# EAGLE board 1203_05 (EAGLE 7.1.0), part 1 of 3
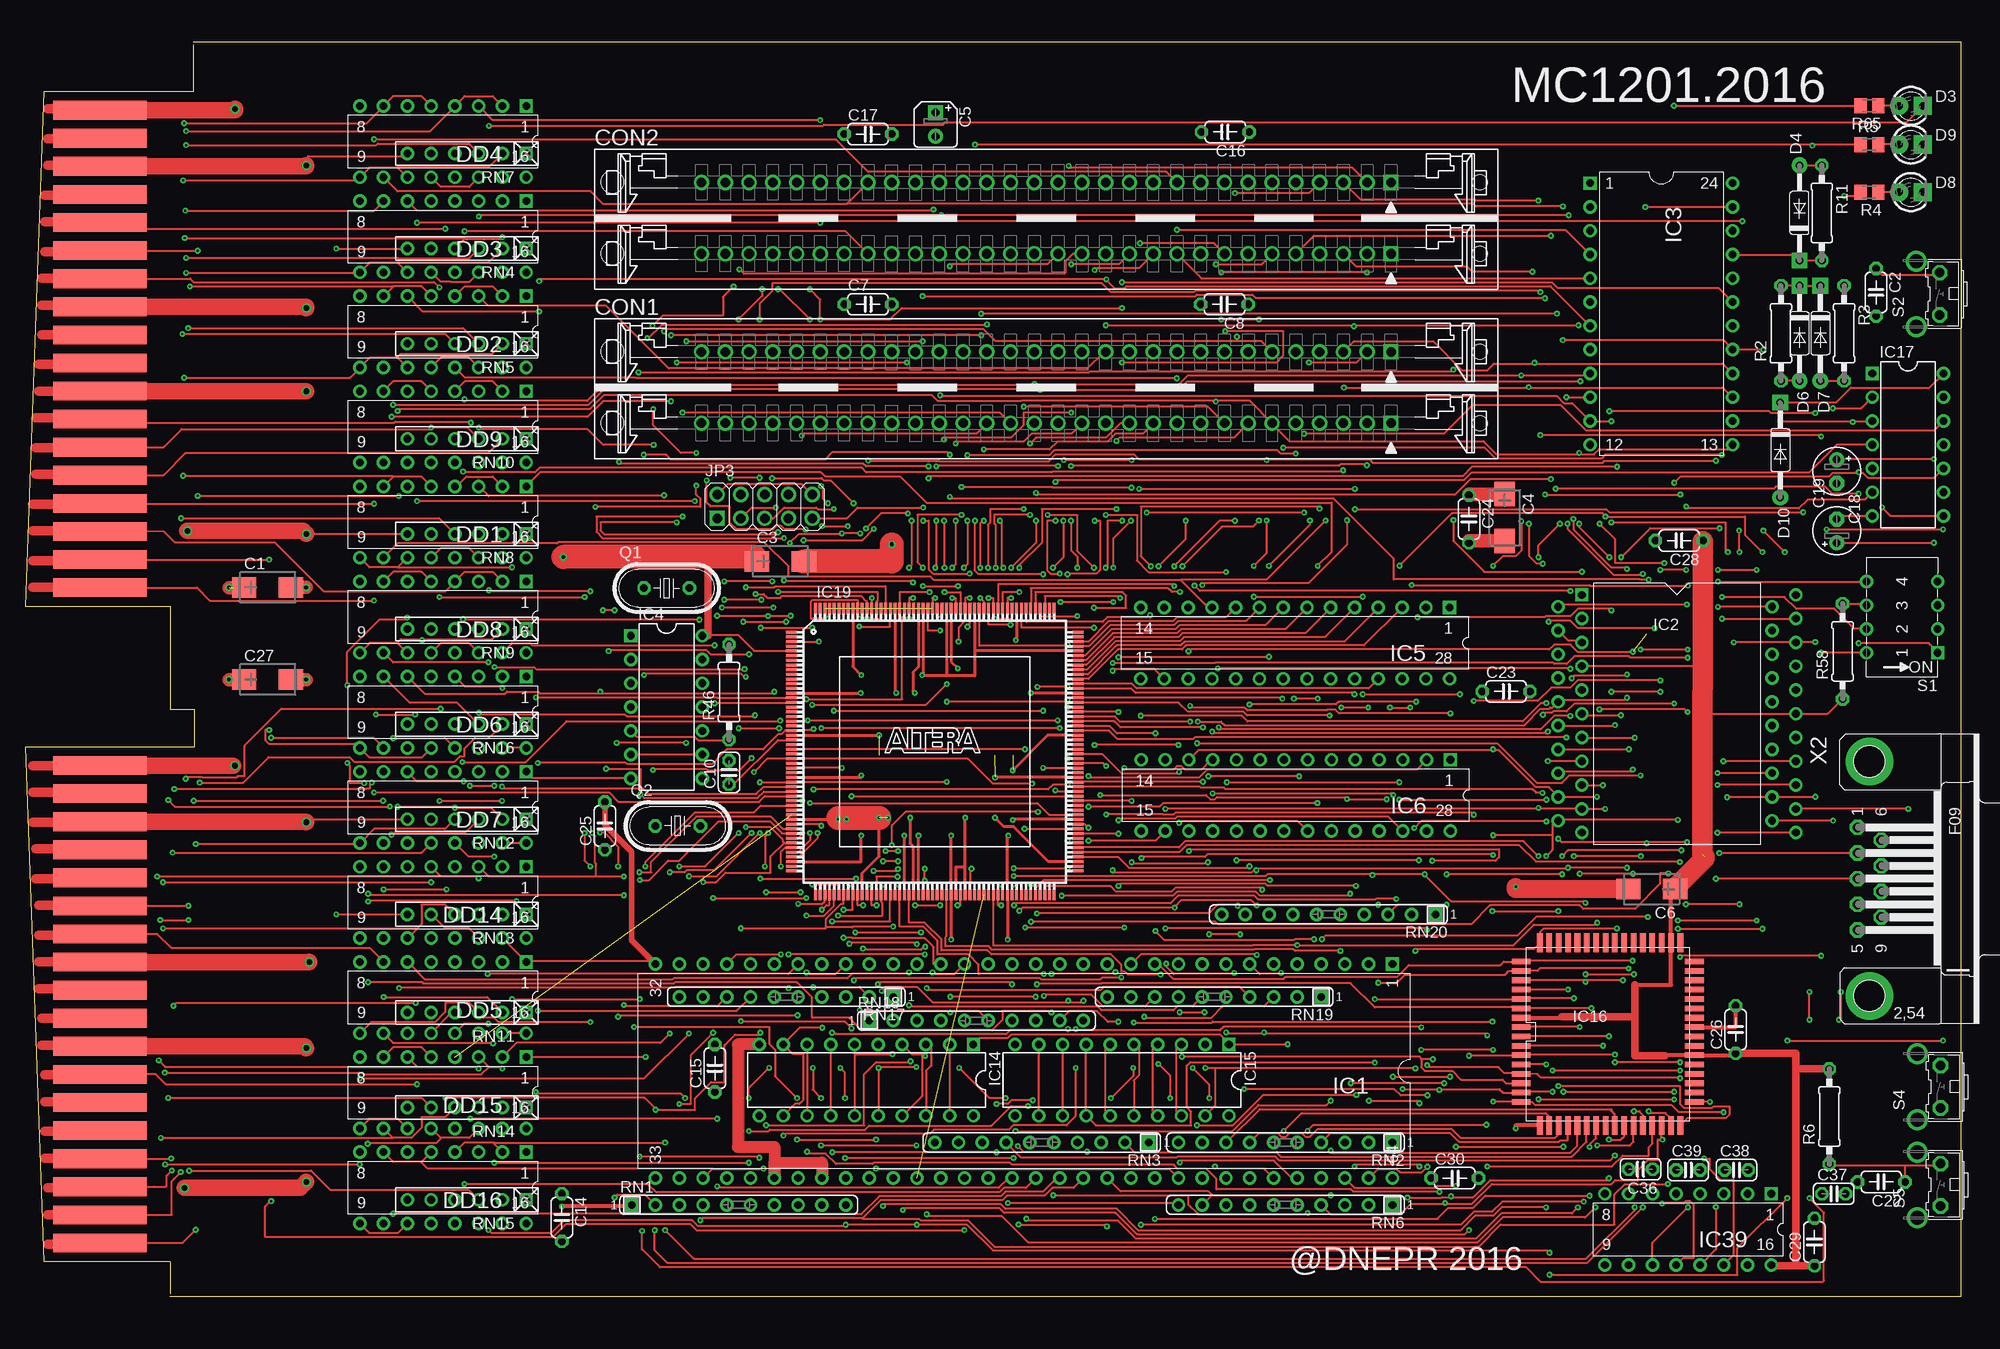
[diagram p2: board, top side]
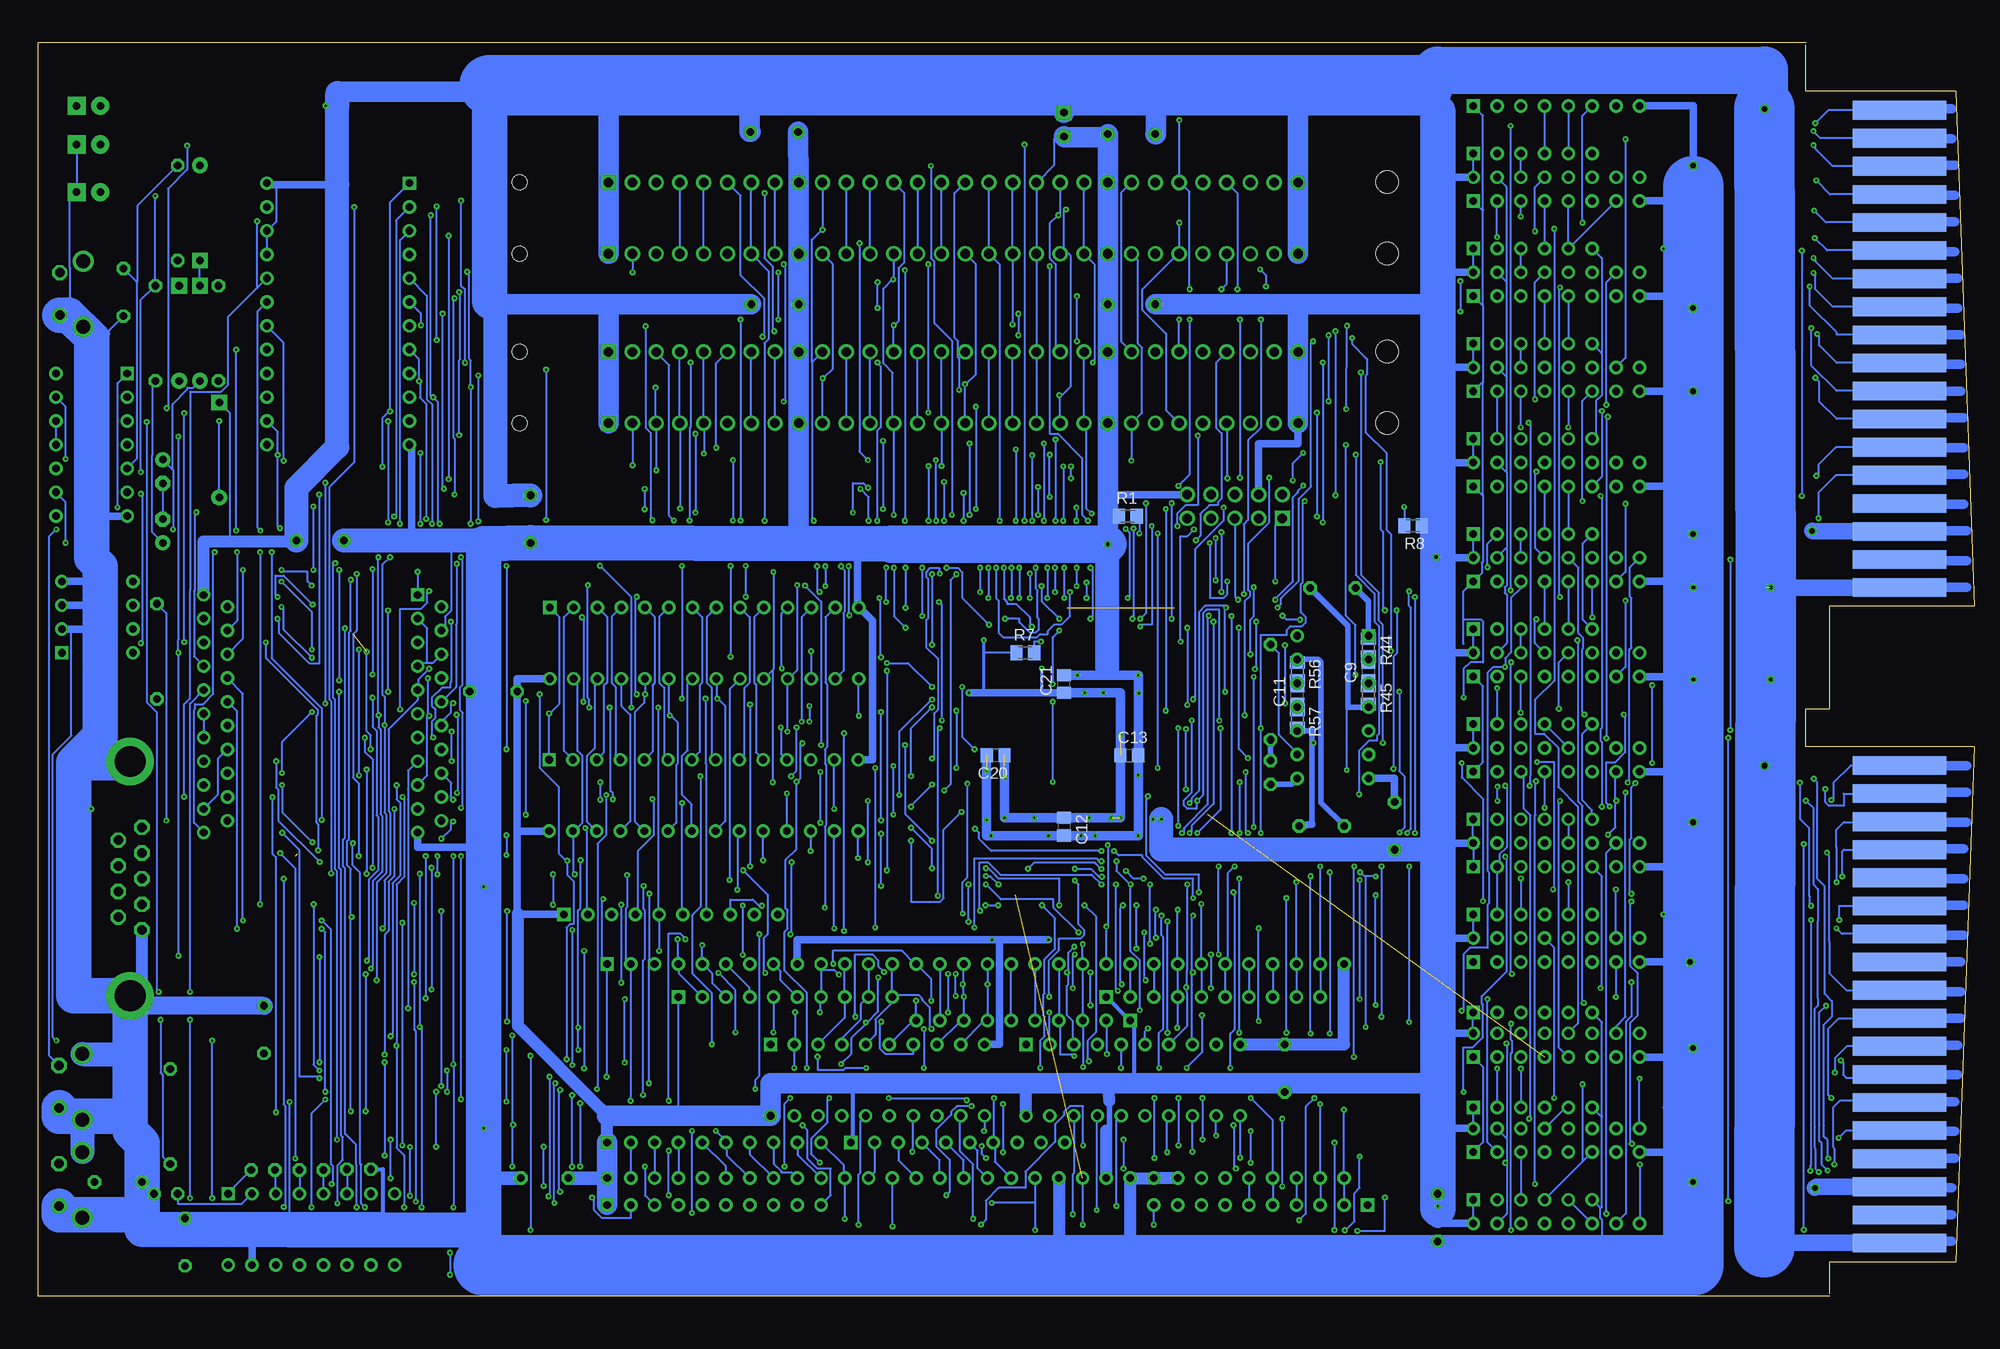
[diagram p3: board, bottom side, seen from below]

Size 206.86 x 133.97 mm. Coordinates in mm from the lower left corner, seen from the top.
Outline: 15.43,0 206.86,0 206.86,133.97 17.97,133.97
Copper layers (1+2*16): Top 0.035mm / dielectric 0.75mm / Route2 0.035mm / dielectric 0.75mm / Bottom 0.035mm
Design rules "default *": minimum track width 8mil, minimum drill 8mil, track to track 8mil, track to pad 8mil, pad to pad 8mil, via to via 8mil, smd to smd 8mil, copper to edge 40mil, drill to drill 8mil, minimum pad ring 12mil, minimum via ring 8mil, stop-mask expansion 0mil, vias tented up to drill 0mil, thermal gap 10mil

## Footprints (pad centres in the part's own frame; a part is rotated, then mirrored left to right if it is on the bottom)
CT6032 = smd 2.6 x 2.2: + -2.5,0; - 2.5,0
C050-024X044 = drill 0.813 octagon: 1 -2.54,0; 2 2.54,0
B45181A = drill 0.813 pad 1.6 square: + -1.27,0 | drill 0.813 pad 1.6: - 1.27,0
C0805 = smd 1.3 x 1.5: 1 -0.95,0; 2 0.95,0
C025-024X044 = drill 0.813 octagon: 1 -1.27,0; 2 1.27,0
E2,5-5 = drill 0.813 pad 1.6: + -1.27,0 | drill 0.813 pad 1.6 octagon: - 1.27,0
SIMM30-2 = drill 1.016 square: 1 35.56,3.81; 1A 35.56,-3.81 | drill 1.016: 2 33.02,3.81; 2A 33.02,-3.81; 3 30.48,3.81; 3A 30.48,-3.81; 4 27.94,3.81; 4A 27.94,-3.81; 5 25.4,3.81; 5A 25.4,-3.81; 6 22.86,3.81; 6A 22.86,-3.81; 7 20.32,3.81; 7A 20.32,-3.81; 8 17.78,3.81; 8A 17.78,-3.81; 9 15.24,3.81; 9A 15.24,-3.81; 10 12.7,3.81; 10A 12.7,-3.81; 11 10.16,3.81; 11A 10.16,-3.81; 12 7.62,3.81; 12A 7.62,-3.81; 13 5.08,3.81; 13A 5.08,-3.81; 14 2.54,3.81; 14A 2.54,-3.81; 15 0,3.81; 15A 0,-3.81; 16 -2.54,3.81; 16A -2.54,-3.81; 17 -5.08,3.81; 17A -5.08,-3.81; 18 -7.62,3.81; 18A -7.62,-3.81; 19 -10.16,3.81; 19A -10.16,-3.81; 20 -12.7,3.81; 20A -12.7,-3.81; 21 -15.24,3.81; 21A -15.24,-3.81; 22 -17.78,3.81; 22A -17.78,-3.81; 23 -20.32,3.81; 23A -20.32,-3.81; 24 -22.86,3.81; 24A -22.86,-3.81; 25 -25.4,3.81; 25A -25.4,-3.81; 26 -27.94,3.81; 26A -27.94,-3.81; 27 -30.48,3.81; 27A -30.48,-3.81; 28 -33.02,3.81; 28A -33.02,-3.81; 29 -35.56,3.81; 29A -35.56,-3.81; 30 -38.1,3.81; 30A -38.1,-3.81 | hole 2.413: -47.65,3.835; -47.65,-3.785 | hole 1.6: 45.085,3.81; 45.085,-3.81
LED3MM = drill 0.813 pad 1.93: A -1.27,0 | drill 0.813 pad 1.93 square: K 1.27,0
DO35-10 = drill 0.813 pad 1.676: A 5.08,0 | drill 0.813 pad 1.676 square: K -5.08,0
DIL16 = drill 0.813 square: 1 -8.89,-3.81 | drill 0.813: 2 -6.35,-3.81; 3 -3.81,-3.81; 4 -1.27,-3.81; 5 1.27,-3.81; 6 3.81,-3.81; 7 6.35,-3.81; 8 8.89,-3.81; 9 8.89,3.81; 10 6.35,3.81; 11 3.81,3.81; 12 1.27,3.81; 13 -1.27,3.81; 14 -3.81,3.81; 15 -6.35,3.81; 16 -8.89,3.81
DIL64 = drill 0.813 square: 1 -39.37,-11.43 | drill 0.813: 2 -36.83,-11.43; 3 -34.29,-11.43; 4 -31.75,-11.43; 5 -29.21,-11.43; 6 -26.67,-11.43; 7 -24.13,-11.43; 8 -21.59,-11.43; 9 -19.05,-11.43; 10 -16.51,-11.43; 11 -13.97,-11.43; 12 -11.43,-11.43; 13 -8.89,-11.43; 14 -6.35,-11.43; 15 -3.81,-11.43; 16 -1.27,-11.43; 17 1.27,-11.43; 18 3.81,-11.43; 19 6.35,-11.43; 20 8.89,-11.43; 21 11.43,-11.43; 22 13.97,-11.43; 23 16.51,-11.43; 24 19.05,-11.43; 25 21.59,-11.43; 26 24.13,-11.43; 27 26.67,-11.43; 28 29.21,-11.43; 29 31.75,-11.43; 30 34.29,-11.43; 31 36.83,-11.43; 32 39.37,-11.43; 33 39.37,11.43; 34 36.83,11.43; 35 34.29,11.43; 36 31.75,11.43; 37 29.21,11.43; 38 26.67,11.43; 39 24.13,11.43; 40 21.59,11.43; 41 19.05,11.43; 42 16.51,11.43; 43 13.97,11.43; 44 11.43,11.43; 45 8.89,11.43; 46 6.35,11.43; 47 3.81,11.43; 48 1.27,11.43; 49 -1.27,11.43; 50 -3.81,11.43; 51 -6.35,11.43; 52 -8.89,11.43; 53 -11.43,11.43; 54 -13.97,11.43; 55 -16.51,11.43; 56 -19.05,11.43; 57 -21.59,11.43; 58 -24.13,11.43; 59 -26.67,11.43; 60 -29.21,11.43; 61 -31.75,11.43; 62 -34.29,11.43; 63 -36.83,11.43; 64 -39.37,11.43
1801 = drill 0.813 square: 1 -10.16,12.7 | drill 0.813: 2 -12.7,11.43; 3 -10.16,10.16; 4 -12.7,8.89; 5 -10.16,7.62; 6 -12.7,6.35; 7 -10.16,5.08; 8 -12.7,3.81; 9 -10.16,2.54; 10 -12.7,1.27; 11 -10.16,0; 12 -12.7,-1.27; 13 -10.16,-2.54; 14 -12.7,-3.81; 15 -10.16,-5.08; 16 -12.7,-6.35; 17 -10.16,-7.62; 18 -12.7,-8.89; 19 -10.16,-10.16; 20 -12.7,-11.43; 21 -10.16,-12.7; 22 12.7,-12.7; 23 10.16,-11.43; 24 12.7,-10.16; 25 10.16,-8.89; 26 12.7,-7.62; 27 10.16,-6.35; 28 12.7,-5.08; 29 10.16,-3.81; 30 12.7,-2.54; 31 10.16,-1.27; 32 12.7,0; 33 10.16,1.27; 34 12.7,2.54; 35 10.16,3.81; 36 12.7,5.08; 37 10.16,6.35; 38 12.7,7.62; 39 10.16,8.89; 40 12.7,10.16; 41 10.16,11.43; 42 12.7,12.7
DIL24 = drill 0.813 square: 1 -13.97,-7.62 | drill 0.813: 2 -11.43,-7.62; 3 -8.89,-7.62; 4 -6.35,-7.62; 5 -3.81,-7.62; 6 -1.27,-7.62; 7 1.27,-7.62; 8 3.81,-7.62; 9 6.35,-7.62; 10 8.89,-7.62; 11 11.43,-7.62; 12 13.97,-7.62; 13 13.97,7.62; 14 11.43,7.62; 15 8.89,7.62; 16 6.35,7.62; 17 3.81,7.62; 18 1.27,7.62; 19 -1.27,7.62; 20 -3.81,7.62; 21 -6.35,7.62; 22 -8.89,7.62; 23 -11.43,7.62; 24 -13.97,7.62
DIL14 = drill 0.813 square: 1 -7.62,-3.81 | drill 0.813: 2 -5.08,-3.81; 3 -2.54,-3.81; 4 0,-3.81; 5 2.54,-3.81; 6 5.08,-3.81; 7 7.62,-3.81; 8 7.62,3.81; 9 5.08,3.81; 10 2.54,3.81; 11 0,3.81; 12 -2.54,3.81; 13 -5.08,3.81; 14 -7.62,3.81
DIL28-3 = drill 0.813 square: 1 -16.51,-3.81 | drill 0.813: 2 -13.97,-3.81; 3 -11.43,-3.81; 4 -8.89,-3.81; 5 -6.35,-3.81; 6 -3.81,-3.81; 7 -1.27,-3.81; 8 1.27,-3.81; 9 3.81,-3.81; 10 6.35,-3.81; 11 8.89,-3.81; 12 11.43,-3.81; 13 13.97,-3.81; 14 16.51,-3.81; 15 16.51,3.81; 16 13.97,3.81; 17 11.43,3.81; 18 8.89,3.81; 19 6.35,3.81; 20 3.81,3.81; 21 1.27,3.81; 22 -1.27,3.81; 23 -3.81,3.81; 24 -6.35,3.81; 25 -8.89,3.81; 26 -11.43,3.81; 27 -13.97,3.81; 28 -16.51,3.81
DIL20 = drill 0.813 square: 1 -11.43,-3.81 | drill 0.813: 2 -8.89,-3.81; 3 -6.35,-3.81; 4 -3.81,-3.81; 5 -1.27,-3.81; 6 1.27,-3.81; 7 3.81,-3.81; 8 6.35,-3.81; 9 8.89,-3.81; 10 11.43,-3.81; 11 11.43,3.81; 12 8.89,3.81; 13 6.35,3.81; 14 3.81,3.81; 15 1.27,3.81; 16 -1.27,3.81; 17 -3.81,3.81; 18 -6.35,3.81; 19 -8.89,3.81; 20 -11.43,3.81
1801VM4 = smd 2 x 0.6: 1 -9.5,-0.5; 2 -9.5,-1.5; 3 -9.5,-2.5; 4 -9.5,-3.5; 5 -9.5,-4.5; 6 -9.5,-5.5; 7 -9.5,-6.5; 8 -9.5,-7.5; 25 9,-7.5; 26 9,-6.5; 27 9,-5.5; 28 9,-4.5; 29 9,-3.5; 30 9,-2.5; 31 9,-1.5; 32 9,-0.5; 33 9,0.5; 34 9,1.5; 35 9,2.5; 36 9,3.5; 37 9,4.5; 38 9,5.5; 39 9,6.5; 40 9,7.5; 57 -9.5,7.5; 58 -9.5,6.5; 59 -9.5,5.5; 60 -9.5,4.5; 61 -9.5,3.5; 62 -9.5,2.5; 63 -9.5,1.5; 64 -9.5,0.5 | smd 0.6 x 2: 9 -7.5,-10; 10 -6.5,-10; 11 -5.5,-10; 12 -4.5,-10; 13 -3.5,-10; 14 -2.5,-10; 15 -1.5,-10; 16 -0.5,-10; 17 0.5,-10; 18 1.5,-10; 19 2.5,-10; 20 3.5,-10; 21 4.5,-10; 22 5.5,-10; 23 6.5,-10; 24 7.5,-10; 41 7.5,9.5; 42 6.5,9.5; 43 5.5,9.5; 44 4.5,9.5; 45 3.5,9.5; 46 2.5,9.5; 47 1.5,9.5; 48 0.5,9.5; 49 -0.5,9.5; 50 -1.5,9.5; 51 -2.5,9.5; 52 -3.5,9.5; 53 -4.5,9.5; 54 -5.5,9.5; 55 -6.5,9.5; 56 -7.5,9.5
RQFP208 = smd 1.2 x 0.32: 1 -15.3,12.75; 2 -15.3,12.25; 3 -15.3,11.75; 4 -15.3,11.25; 5 -15.3,10.75; 6 -15.3,10.25; 7 -15.3,9.75; 8 -15.3,9.25; 9 -15.3,8.75; 10 -15.3,8.25; 11 -15.3,7.75; 12 -15.3,7.25; 13 -15.3,6.75; 14 -15.3,6.25; 15 -15.3,5.75; 16 -15.3,5.25; 17 -15.3,4.75; 18 -15.3,4.25; 19 -15.3,3.75; 20 -15.3,3.25; 21 -15.3,2.75; 22 -15.3,2.25; 23 -15.3,1.75; 24 -15.3,1.25; 25 -15.3,0.75; 26 -15.3,0.25; 27 -15.3,-0.25; 28 -15.3,-0.75; 29 -15.3,-1.25; 30 -15.3,-1.75; 31 -15.3,-2.25; 32 -15.3,-2.75; 33 -15.3,-3.25; 34 -15.3,-3.75; 35 -15.3,-4.25; 36 -15.3,-4.75; 37 -15.3,-5.25; 38 -15.3,-5.75; 39 -15.3,-6.25; 40 -15.3,-6.75; 41 -15.3,-7.25; 42 -15.3,-7.75; 43 -15.3,-8.25; 44 -15.3,-8.75; 45 -15.3,-9.25; 46 -15.3,-9.75; 47 -15.3,-10.25; 48 -15.3,-10.75; 49 -15.3,-11.25; 50 -15.3,-11.75; 51 -15.3,-12.25; 52 -15.3,-12.75; 105 15.3,-12.75; 106 15.3,-12.25; 107 15.3,-11.75; 108 15.3,-11.25; 109 15.3,-10.75; 110 15.3,-10.25; 111 15.3,-9.75; 112 15.3,-9.25; 113 15.3,-8.75; 114 15.3,-8.25; 115 15.3,-7.75; 116 15.3,-7.25; 117 15.3,-6.75; 118 15.3,-6.25; 119 15.3,-5.75; 120 15.3,-5.25; 121 15.3,-4.75; 122 15.3,-4.25; 123 15.3,-3.75; 124 15.3,-3.25; 125 15.3,-2.75; 126 15.3,-2.25; 127 15.3,-1.75; 128 15.3,-1.25; 129 15.3,-0.75; 130 15.3,-0.25; 131 15.3,0.25; 132 15.3,0.75; 133 15.3,1.25; 134 15.3,1.75; 135 15.3,2.25; 136 15.3,2.75; 137 15.3,3.25; 138 15.3,3.75; 139 15.3,4.25; 140 15.3,4.75; 141 15.3,5.25; 142 15.3,5.75; 143 15.3,6.25; 144 15.3,6.75; 145 15.3,7.25; 146 15.3,7.75; 147 15.3,8.25; 148 15.3,8.75; 149 15.3,9.25; 150 15.3,9.75; 151 15.3,10.25; 152 15.3,10.75; 153 15.3,11.25; 154 15.3,11.75; 155 15.3,12.25; 156 15.3,12.75 | smd 0.32 x 1.2: 53 -12.75,-15.3; 54 -12.25,-15.3; 55 -11.75,-15.3; 56 -11.25,-15.3; 57 -10.75,-15.3; 58 -10.25,-15.3; 59 -9.75,-15.3; 60 -9.25,-15.3; 61 -8.75,-15.3; 62 -8.25,-15.3; 63 -7.75,-15.3; 64 -7.25,-15.3; 65 -6.75,-15.3; 66 -6.25,-15.3; 67 -5.75,-15.3; 68 -5.25,-15.3; 69 -4.75,-15.3; 70 -4.25,-15.3; 71 -3.75,-15.3; 72 -3.25,-15.3; 73 -2.75,-15.3; 74 -2.25,-15.3; 75 -1.75,-15.3; 76 -1.25,-15.3; 77 -0.75,-15.3; 78 -0.25,-15.3; 79 0.25,-15.3; 80 0.75,-15.3; 81 1.25,-15.3; 82 1.75,-15.3; 83 2.25,-15.3; 84 2.75,-15.3; 85 3.25,-15.3; 86 3.75,-15.3; 87 4.25,-15.3; 88 4.75,-15.3; 89 5.25,-15.3; 90 5.75,-15.3; 91 6.25,-15.3; 92 6.75,-15.3; 93 7.25,-15.3; 94 7.75,-15.3; 95 8.25,-15.3; 96 8.75,-15.3; 97 9.25,-15.3; 98 9.75,-15.3; 99 10.25,-15.3; 100 10.75,-15.3; 101 11.25,-15.3; 102 11.75,-15.3; 103 12.25,-15.3; 104 12.75,-15.3; 157 12.75,15.3; 158 12.25,15.3; 159 11.75,15.3; 160 11.25,15.3; 161 10.75,15.3; 162 10.25,15.3; 163 9.75,15.3; 164 9.25,15.3; 165 8.75,15.3; 166 8.25,15.3; 167 7.75,15.3; 168 7.25,15.3; 169 6.75,15.3; 170 6.25,15.3; 171 5.75,15.3; 172 5.25,15.3; 173 4.75,15.3; 174 4.25,15.3; 175 3.75,15.3; 176 3.25,15.3; 177 2.75,15.3; 178 2.25,15.3; 179 1.75,15.3; 180 1.25,15.3; 181 0.75,15.3; 182 0.25,15.3; 183 -0.25,15.3; 184 -0.75,15.3; 185 -1.25,15.3; 186 -1.75,15.3; 187 -2.25,15.3; 188 -2.75,15.3; 189 -3.25,15.3; 190 -3.75,15.3; 191 -4.25,15.3; 192 -4.75,15.3; 193 -5.25,15.3; 194 -5.75,15.3; 195 -6.25,15.3; 196 -6.75,15.3; 197 -7.25,15.3; 198 -7.75,15.3; 199 -8.25,15.3; 200 -8.75,15.3; 201 -9.25,15.3; 202 -9.75,15.3; 203 -10.25,15.3; 204 -10.75,15.3; 205 -11.25,15.3; 206 -11.75,15.3; 207 -12.25,15.3; 208 -12.75,15.3
2X05 = drill 1.016 square: 1 -5.08,-1.27 | drill 1.016: 2 -5.08,1.27; 3 -2.54,-1.27; 4 -2.54,1.27; 5 0,-1.27; 6 0,1.27; 7 2.54,-1.27; 8 2.54,1.27; 9 5.08,-1.27; 10 5.08,1.27
HC49U70 = drill 0.813 octagon: 1 -2.413,0; 2 2.413,0
M0805 = smd 1.3 x 1.6: 1 -0.95,0; 2 0.95,0
0207/10 = drill 0.813 octagon: 1 -5.08,0; 2 5.08,0
SIL10 = drill 0.813 square: 1 -11.43,0 | drill 0.813: 2 -8.89,0; 3 -6.35,0; 4 -3.81,0; 5 -1.27,0; 6 1.27,0; 7 3.81,0; 8 6.35,0; 9 8.89,0; 10 11.43,0
RN-6 = drill 0.813 square: 1 -6.35,0 | drill 0.813: 2 -3.81,0; 3 -1.27,0; 4 1.27,0; 5 3.81,0; 6 6.35,0
DIP04SB = drill 0.813 square: 1 -3.81,-3.81 | drill 0.813: 2 -1.27,-3.81; 3 1.27,-3.81; 4 3.81,-3.81; 5 3.81,3.81; 6 1.27,3.81; 7 -1.27,3.81; 8 -3.81,3.81
B3F-31XX = drill 1.016 octagon: 1 -2.261,-1.245; 2 2.261,-1.245 | drill 1.499 pad 2.159: 3 -3.505,1.245; 4 3.505,1.245
F09HP = drill 1.016 octagon: 1 -5.486,-1.27; 2 -2.743,-1.27; 3 0,-1.27; 4 2.743,-1.27; 5 5.486,-1.27; 6 -4.115,1.27; 7 -1.372,1.27; 8 1.372,1.27; 9 4.115,1.27 | drill 3.302 pad 5.08: G1 -12.522,0; G2 12.522,0
CON1 = smd 2 x 10: AA1 60.5,7.5; AA2 57.5,7.5; AA3 54.5,7.5; AA4 51.5,7.5; AA5 48.5,7.5; AA6 45.5,7.5; AA7 42.5,7.5; AA8 39.5,7.5; AA9 36.5,7.5; AA10 33.5,7.5; AA11 30.5,7.5; AA12 27.5,7.5; AA13 24.5,7.5; AA14 21.5,7.5; AA15 18.5,7.5; AA16 15.5,7.5; AA17 12.5,7.5; AA18 9.5,7.5; BA1 -9.5,7.5; BA2 -12.5,7.5; BA3 -15.5,7.5; BA4 -18.5,7.5; BA5 -21.5,7.5; BA6 -24.5,7.5; BA7 -27.5,7.5; BA8 -30.5,7.5; BA9 -33.5,7.5; BA10 -36.5,7.5; BA11 -39.5,7.5; BA12 -42.5,7.5; BA13 -45.5,7.5; BA14 -48.5,7.5; BA15 -51.5,7.5; BA16 -54.5,7.5; BA17 -57.5,7.5; BA18 -60.5,7.5 | smd 2 x 10 bottom: AB1 60.5,7.5; AB2 57.5,7.5; AB3 54.5,7.5; AB4 51.5,7.5; AB5 48.5,7.5; AB6 45.5,7.5; AB7 42.5,7.5; AB8 39.5,7.5; AB9 36.5,7.5; AB10 33.5,7.5; AB11 30.5,7.5; AB12 27.5,7.5; AB13 24.5,7.5; AB14 21.5,7.5; AB15 18.5,7.5; AB16 15.5,7.5; AB17 12.5,7.5; AB18 9.5,7.5; BB1 -9.5,7.5; BB2 -12.5,7.5; BB3 -15.5,7.5; BB4 -18.5,7.5; BB5 -21.5,7.5; BB6 -24.5,7.5; BB7 -27.5,7.5; BB8 -30.5,7.5; BB9 -33.5,7.5; BB10 -36.5,7.5; BB11 -39.5,7.5; BB12 -42.5,7.5; BB13 -45.5,7.5; BB14 -48.5,7.5; BB15 -51.5,7.5; BB16 -54.5,7.5; BB17 -57.5,7.5; BB18 -60.5,7.5

## Placement (x,y rotation side)
C1  [CT6032]  25.9,75.72 0 top
C2  [C050-024X044]  197.75,107.23 270 top
C3  [CT6032]  80.67,78.5 0 top
C4  [CT6032]  158.06,83.18 270 top
C5  [B45181A]  97.26,125.17 270 top
C6  [CT6032]  173.78,43.49 180 top
C7  [C050-024X044]  90.03,105.96 0 top
C8  [C050-024X044]  128.13,105.96 180 top
C9  [C0805]  64.71,66.75 90 bottom
C10  [C025-024X044]  75.19,55.95 90 top
C11  [C0805]  72.33,64.21 90 bottom
C12  [C0805]  97.26,50.16 270 bottom
C13  [C0805]  90.27,57.78 0 bottom
C14  [C050-024X044]  57.33,8.41 270 top
C15  [C050-024X044]  73.68,24.36 90 top
C16  [C050-024X044]  128.21,124.37 180 top
C17  [C050-024X044]  90.03,124.14 0 top
C18  [E2,5-5]  193.54,88.1 270 top
C19  [E2,5-5]  193.54,81.75 90 top
C20  [C0805]  104.56,57.78 180 bottom
C21  [C0805]  97.26,65.4 90 bottom
C22  [C050-024X044]  198.3,12.22 180 top
C23  [C050-024X044]  158.22,64.61 0 top
C24  [C050-024X044]  154.25,83.02 270 top
C25  [C050-024X044]  61.94,50.24 90 top
C26  [C050-024X044]  182.75,28.49 90 top
C27  [CT6032]  25.9,65.88 0 top
C28  [C050-024X044]  176.71,80.72 180 top
C29  [C050-024X044]  191.16,5.79 90 top
C30  [C050-024X044]  152.74,12.61 0 top
C36  [C025-024X044]  172.58,13.57 180 top
C37  [C025-024X044]  193.22,10.95 0 top
C38  [C025-024X044]  182.82,13.49 0 top
C39  [C025-024X044]  177.66,13.49 0 top
CON1  [SIMM30-2]  110.35,97.07 0 top
CON2  [SIMM30-2]  110.35,115.17 0 top
D3  LED3MM  [LED3MM]  201.48,127.15 0 top
D4  1N4148  [DO35-10]  189.57,115.72 90 top
D6  1N4148  [DO35-10]  189.57,102.86 270 top
D7  1N4148  [DO35-10]  191.79,102.86 270 top
D8  LED3MM  [LED3MM]  201.48,117.94 0 top
D9  LED3MM  [LED3MM]  201.48,123.02 0 top
D10  1N4148  [DO35-10]  187.51,90.4 270 top
DD1  531AP2  [DIL16]  44.63,82.7 180 top
DD2  531AP2  [DIL16]  44.63,103.02 180 top
DD3  531AP2  [DIL16]  44.63,113.18 180 top
DD4  531AP2  [DIL16]  44.63,123.34 180 top
DD5  531AP2  [DIL16]  44.63,31.9 180 top
DD6  531AP2  [DIL16]  44.63,62.38 180 top
DD7  531AP2  [DIL16]  44.63,52.22 180 top
DD8  531AP2  [DIL16]  44.63,72.54 180 top
DD9  531AP2  [DIL16]  44.63,92.86 180 top
DD14  531AP2  [DIL16]  44.63,42.06 180 top
DD15  531AP2  [DIL16]  44.63,21.74 180 top
DD16  531AP2  [DIL16]  44.63,11.58 180 top
IC1  1801M03  [DIL64]  106.7,24.04 180 top
IC2  1801VP1-065  [1801]  176.47,62.22 0 top
IC3  [DIL24]  174.81,104.93 270 top
IC4  74ALS05N  [DIL14]  68.52,62.94 270 top
IC5  [DIL28-3]  135.68,69.76 180 top
IC6  [DIL28-3]  135.75,53.49 180 top
IC14  74AS574N  [DIL20]  89.88,23.09 180 top
IC15  74AS574N  [DIL20]  117.18,23.09 180 top
IC16  1801VM4  [1801VM4]  169.33,28.25 0 top
IC17  74AC14N  [DIL14]  201.16,90.96 270 top
IC19  EPM7256-Q208  [RQFP208]  97.18,58.18 0 top
IC39  MAX232  [DIL16]  177.66,7.14 180 top
JP3  [2X05]  79,84.37 0 top
Q1  [HC49U70]  68.52,75.64 0 top
Q2  [HC49U70]  69.71,50.24 0 top
R1  [M0805]  90.43,83.34 0 bottom
R2  [0207/10]  187.59,102.86 90 top
R3  [0207/10]  194.33,102.86 270 top
R4  [M0805]  197.03,117.94 180 top
R5  [M0805]  197.03,123.02 0 top
R6  [0207/10]  192.75,19.2 90 top
R7  [M0805]  101.39,68.73 0 bottom
R8  [M0805]  59.95,82.31 180 bottom
R11  [0207/10]  191.95,115.72 270 top
R44  [M0805]  64.71,69.29 270 bottom
R45  [M0805]  64.71,64.21 270 bottom
R46  [0207/10]  75.19,64.53 90 top
R56  [M0805]  72.33,66.75 270 bottom
R57  [M0805]  72.33,61.67 270 bottom
R58  [0207/10]  194.17,68.89 90 top
R65  [M0805]  197.03,127.15 180 top
RN1  [SIL10]  76.22,9.76 0 top
RN2  [SIL10]  134.64,16.42 180 top
RN3  [SIL10]  108.61,16.42 180 top
RN4  [RN-6]  47.17,111.91 180 top
RN5  [RN-6]  47.17,101.75 180 top
RN6  [SIL10]  134.64,9.76 180 top
RN7  [RN-6]  47.17,122.07 180 top
RN8  [RN-6]  47.17,81.43 180 top
RN9  [RN-6]  47.17,71.27 180 top
RN10  [RN-6]  47.17,91.59 180 top
RN11  [RN-6]  47.17,30.32 180 top
RN12  [RN-6]  47.17,50.95 180 top
RN13  [RN-6]  47.17,40.79 180 top
RN14  [RN-6]  47.17,20.16 180 top
RN15  [RN-6]  47.17,10.31 180 top
RN16  [RN-6]  47.17,61.11 180 top
RN17  [SIL10]  81.3,31.98 180 top
RN18  [SIL10]  101.62,29.44 0 top
RN19  [SIL10]  127.02,31.98 180 top
RN20  [SIL10]  139.25,40.79 180 top
S1  [DIP04SB]  200.53,72.54 90 top
S2  [B3F-31XX]  203.3,107.07 90 top
S4  [B3F-31XX]  203.38,22.38 90 top
S5  [B3F-31XX]  203.38,11.9 90 top
X2  [F09HP]  197.03,44.6 270 top
XP1  [CON1]  0.5,66.19 270 top

## Tracks (layer width: path | path; a pad name or v marks a point on that pad's centre or on a via)
1D1  (via drill 0.2)
  Top 0.203: v54.56,63.96 73.91,63.96 73.93,63.94 81.86,63.94 IC19.15 | v138.08,63.84 v135.56,63.84 | v138.08,78.01 139.56,79.49 139.56,84.76 96.28,84.76 93.46,87.59 85.46,87.59 84.98,88.06 55.08,88.06 DD1.1
  Bottom 0.203: 54.56,69.66 54.56,72.31 | 54.56,72.31 54.56,75.31 53.53,76.34 DD8.1 53.43,76.41 52.63,77.21 52.63,78.34 52.48,78.49 52.48,85.49 52.55,85.55 | 52.55,97.65 52.48,97.71 52.48,105.79 52.55,105.85 | 52.55,97.65 DD9.1 | 52.55,105.85 53.51,106.81 DD2.1 | 52.55,116.02 52.48,115.96 52.48,105.91 52.55,105.85 | 52.55,116.02 53.51,116.99 DD3.1 | DD4.1 52.48,126.11 52.48,116.09 52.55,116.02 | v54.56,63.96 54.56,67.01 53.86,67.71 52.48,67.71 52.48,72.09 52.71,72.31 54.56,72.31 | RN20.7 135.51,40.86 135.51,55.26 135.48,55.29 135.48,56.86 135.56,56.94 v135.56,63.84 | v138.08,78.01 v138.08,63.84 | 52.55,85.55 53.51,86.51 DD1.1 | 52.55,97.65 52.48,97.59 52.48,85.61 52.55,85.55
1MA0  (via drill 0.2)
  Top 0.203: v120.18,72.74 119.98,72.54 115.61,72.54 115.11,72.04 106.93,72.04 IC19.163 | v120.26,77.99 119.18,79.06 119.18,84.34 138.08,84.34 v138.28,84.14
  Bottom 0.203: v120.18,72.74 120.26,72.81 v120.26,77.99 | v138.28,84.14 138.28,93.24 CON1.4A 138.31,93.36 138.31,100.86 CON1.4
1MA1  (via drill 0.2)
  Top 0.203: v103.56,72.36 105.41,72.36 105.41,73.46 IC19.166 | v100.28,77.81 100.66,78.19 v100.66,82.84 | v100.66,89.84 109.41,89.84 109.93,90.36 133.81,90.36 134.16,90.01 v135.73,90.01
  Bottom 0.202: 100.13,72.51 99.96,72.34 99.96,71.19 100.27,70.88 100.91,70.88 102.02,71.99 102.02,72.38 102.04,72.36 v103.56,72.36
  Bottom 0.203: 100.13,72.51 100.13,75.46 100.28,75.61 v100.28,77.81 | v100.66,89.84 v100.66,82.84 | v135.73,90.01 135.73,93.24 CON1.5A 135.76,93.34 135.76,100.86 CON1.5
1MA2  (via drill 0.2)
  Top 0.203: v106.21,75.21 104.43,75.21 104.43,73.49 IC19.168 | v106.21,77.81 106.21,78.11 108.61,80.51 108.61,84.09 v116.58,84.09 | v116.58,91.36 116.93,91.71 129.13,91.71 130.66,93.24 CON1.7A
  Bottom 0.203: v106.21,77.81 v106.21,75.21 | v116.58,91.36 v116.58,84.09 | CON1.7 130.68,100.86 CON1.7A
1MA3  (via drill 0.2)
  Top 0.203: v102.91,74.59 103.41,74.59 103.41,73.49 IC19.170 | v102.86,77.81 102.86,82.41 103.08,82.64 103.08,84.09 v106.68,84.09 | v106.68,95.01 126.38,95.01 CON1.8A
  Bottom 0.203: v102.91,74.59 102.86,74.64 v102.86,77.81 | v106.68,95.01 v106.68,84.09 | CON1.8 128.13,100.86 CON1.8A
1MA4  (via drill 0.2)
  Top 0.203: v102.03,74.59 102.41,74.21 102.41,73.49 IC19.172 | v102.03,77.81 102.03,82.51 102.36,82.84 v102.41,82.84 | v102.41,90.46 109.46,90.46 110.28,91.29 115.63,91.29 116.48,92.14 119.41,92.14 120.51,93.24 CON1.11A
  Bottom 0.203: v102.03,77.81 v102.03,74.59 | v102.41,90.46 v102.41,82.84 | CON1.11 120.51,100.86 CON1.11A
1MA5  (via drill 0.2)
  Top 0.202: IC19.175 100.91,73.46 100.91,71.83 100.67,71.59 v100.67,71.51
  Top 0.203: v103.68,77.81 103.68,82.41 103.51,82.59 103.51,83.46 v107.36,83.46 | v107.36,91.09 107.98,91.71 115.48,91.71 117.01,93.24 117.96,93.24 CON1.12A | 100.91,73.46 IC19.175
  Bottom 0.202: v100.67,71.51 100.91,71.75 100.91,72.51 102.36,73.96
  Bottom 0.203: 102.36,73.96 103.33,73.96 103.33,74.14 103.68,74.49 v103.68,77.81 | v107.36,91.09 v107.36,83.46 | CON1.12 117.98,100.86 CON1.12A
1MA6  (via drill 0.2)
  Top 0.203: v99.03,74.59 99.41,74.59 99.41,73.49 IC19.178 | v99.03,77.81 99.41,78.19 v99.41,82.84 | v99.41,91.09 99.61,91.29 106.68,91.29 107.53,92.14 111.78,92.14 112.88,93.24 CON1.14A
  Bottom 0.203: v99.03,77.81 v99.03,74.59 | v99.41,91.09 v99.41,82.84 | CON1.14 112.91,100.86 CON1.14A
1MA7  (via drill 0.2)  (1 unrouted)
  Top 0.203: v97.23,74.59 96.93,74.59 96.93,73.49 IC19.183 | v97.23,77.81 97.33,77.91 v97.33,82.84 | v97.33,88.64 97.38,88.69 v110.33,88.69
  Bottom 0.203: v97.23,77.81 v97.23,74.59 | v97.33,88.64 v97.33,82.84 | v110.33,88.69 110.33,93.24 CON1.15A 110.36,93.34 110.36,100.86 CON1.15
1MA8  (via drill 0.2)
  Top 0.203: v94.86,74.59 94.43,74.59 94.43,73.49 IC19.188 | v94.86,76.24 94.66,76.44 81.11,76.44 v81.06,76.49 | v81.06,80.99 61.68,80.99 61.03,81.64 61.03,83.29 v70.23,83.29 | v70.23,94.39 104.13,94.39 105.26,93.26 CON1.17A
  Bottom 0.203: v94.86,76.24 v94.86,74.59 | v81.06,80.99 v81.06,76.49 | v70.23,94.39 v70.23,83.29 | CON1.17 105.28,100.86 CON1.17A
1MA9  (via drill 0.2)
  Top 0.203: v89.11,71.54 92.41,71.54 92.41,73.46 IC19.192 | v85.13,82.26 v87.88,82.26 | v82.96,91.94 83.16,92.14 101.63,92.14 102.73,93.24 CON1.18A
  Bottom 0.203: v89.11,71.54 88.91,71.74 87.88,71.74 v87.88,82.26 | v85.13,82.26 85.21,82.34 85.21,83.56 84.26,84.51 82.96,84.51 v82.96,91.94 | CON1.18 102.73,100.86 CON1.18A
2MA0  (via drill 0.2)
  Top 0.203: v114.18,71.41 106.43,71.41 IC19.164 | v115.43,77.81 115.63,78.01 115.63,82.84 v117.21,82.84 | v117.18,99.74 133.66,99.74 134.36,100.44 134.36,103.11 128.23,103.11 v128.21,103.09 | v129.26,117.84 137.16,117.84 138.28,118.96 CON2.4
  Bottom 0.203: v114.18,71.41 115.43,72.66 v115.43,77.81 | v117.21,82.84 117.21,92.44 116.83,92.81 116.83,99.34 117.18,99.69 v117.18,99.74 | v128.21,103.09 128.41,103.29 128.41,110.04 129.26,110.89 v129.26,117.84 | CON2.4A CON2.4
2MA1  (via drill 0.2)
  Top 0.203: v105.33,74.59 104.93,74.59 104.93,73.49 IC19.167 | v105.33,77.81 107.98,80.46 v107.98,82.84 | v107.98,85.81 108.18,85.61 152.73,85.61 154.41,87.29 v163.01,87.29 | v163.01,113.29 137.68,113.29 CON2.5A
  Bottom 0.203: v105.33,77.81 v105.33,74.59 | v107.98,85.81 v107.98,82.84 | v163.01,113.29 v163.01,87.29 | CON2.5 CON2.5A
2MA2  (via drill 0.2)
  Top 0.203: v122.76,75.86 122.56,76.06 103.93,76.06 103.93,73.49 IC19.169 | v122.76,77.99 127.61,82.84 v129.26,82.84
  Bottom 0.203: v122.76,77.99 v122.76,75.86 | v129.26,82.84 129.26,101.81 128.83,102.24 128.83,109.51 130.66,111.34 CON2.7A 130.68,111.44 CON2.7
2MA3  (via drill 0.2)
  Top 0.203: v105.26,71.74 102.93,71.74 IC19.171 | v109.81,77.81 110.91,78.91 v110.91,82.84 | v118.21,89.31 v110.96,89.31 | v119.11,112.49 127.01,112.49 CON2.8A
  Bottom 0.203: v105.26,71.74 108.13,74.61 108.13,77.36 108.58,77.81 v109.81,77.81 | v110.91,82.84 110.96,82.89 v110.96,89.31 | v118.21,89.31 119.11,90.21 v119.11,112.49 | CON2.8 CON2.8A
2MA4  (via drill 0.2)
  Top 0.203: v111.36,69.59 111.23,69.46 101.93,69.46 IC19.173 | v111.36,77.11 111.43,77.19 114.43,77.19 114.81,77.56 114.81,82.84 v114.26,82.84 | v114.26,109.61 114.46,109.81 118.98,109.81 120.51,111.34 CON2.11A
  Bottom 0.203: v111.36,77.11 v111.36,69.59 | v114.26,109.61 v114.26,82.84 | CON2.11 CON2.11A
2MA5  (via drill 0.2)
  Top 0.203: v98.21,75.21 99.91,75.21 99.91,73.49 IC19.177 | v98.21,77.81 98.16,77.86 v98.16,82.84 | v98.16,91.51 98.36,91.71 105.33,91.71 106.68,93.06 106.68,94.39 v111.76,94.39 | v111.76,110.24 116.86,110.24 117.96,111.34 CON2.12A
  Bottom 0.203: v98.21,77.81 v98.21,75.21 | v98.16,91.51 v98.16,82.84 | v111.76,110.24 v111.76,94.39 | CON2.12 CON2.12A
2MA6  (via drill 0.2, 0.6)
  Top 0.202: IC19.3 v84.8,69.92 | v83.37,81.91 81.15,81.91 80.75,82.31 80.27,82.31 79.88,81.91 75.99,81.91 75.27,82.62 75.27,84.29 75.19,84.37 73.21,84.37 72.81,84.77 v72.81,87.15 | v71.7,90.08 70.03,90.08 67.1,93.02 v67.1,94.77 | v67.02,103.66 68.13,104.77 74.56,104.77
  Top 0.203: v112.91,111.36 111.95,111.36 111.15,110.56 111.15,109.37 110.99,109.21 76.78,109.21 v76.3,109.69 | v75.67,107.86 74.56,106.75 74.56,104.77
  Bottom 0.202: v84.8,69.92 84.8,81.19 84.08,81.19 v83.37,81.91 | v72.81,87.15 72.81,88.97 v71.7,90.08 | v67.1,94.77 v67.02,103.66
  Bottom 0.203: CON2.14A v112.91,111.36 CON2.14 | v76.3,109.69 75.67,109.05 v75.67,107.86
2MA7  (via drill 0.2)
  Top 0.203: v94.43,72.36 94.91,72.36 94.91,73.46 IC19.187 | v94.43,77.81 94.68,78.06 v94.68,82.84 | v98.78,110.01 99.01,110.24 109.23,110.24 110.33,111.34 CON2.15A
  Bottom 0.203: v94.43,72.36 94.23,72.56 94.23,77.61 v94.43,77.81 | v94.68,82.84 95.31,83.46 95.31,89.54 97.91,92.14 98.78,92.14 v98.78,110.01 | CON2.15 CON2.15A
2MA8  (via drill 0.2)
  Top 0.203: v96.61,75.21 93.43,75.21 93.43,73.49 IC19.190 | v104.51,77.81 104.31,78.01 104.31,82.84 v104.13,82.84
  Bottom 0.202: 97.51,71.74 98.3,71.74 99,71.03 99,70.72 99.8,70.72 100.12,70.4 103.77,70.4 104.24,70.88 104.24,74.3 104.51,74.56
  Bottom 0.203: v96.61,75.21 96.61,72.64 97.51,71.74 | v104.51,77.81 104.51,74.56 | v104.13,82.84 104.13,110.21 105.26,111.34 CON2.17A 105.28,111.44 CON2.17
2MA9  (via drill 0.2)
  Top 0.203: v76.98,75.74 80.06,75.74 80.18,75.86 91.91,75.86 91.91,73.49 IC19.193 | v77.33,68.59 73.21,68.59 72.76,69.04 62.46,69.04 v62.33,68.91 | v66.46,102.36 66.6,102.36 67.97,103.74 102.66,103.71 v102.76,103.81
  Bottom 0.202: 65.03,100.26 66.46,101.69 v66.46,102.36
  Bottom 0.203: v76.98,75.74 76.98,72.64 77.33,72.29 v77.33,68.59 | v62.33,68.91 62.33,81.41 62.81,81.89 62.81,90.09 65.03,92.31 65.03,98.31 64.91,98.44 64.91,100.14 65.03,100.26 | v102.76,103.81 102.76,111.34 CON2.18A 102.73,111.44 CON2.18
15D1  (via drill 0.2)
  Top 0.203: v73.66,63.34 73.73,63.41 81.86,63.41 IC19.16 | v73.66,69.54 54.16,69.54 53.93,69.76 52.01,69.76 DD8.15
  Bottom 0.203: v73.66,69.54 v73.66,63.34 | 50.02,79.88 49.96,79.94 49.96,88.01 50.02,88.08 | 50.02,79.88 50.98,78.91 DD1.15 | 50.02,88.08 50.98,89.04 DD9.15 | 50.02,98.25 49.96,98.19 49.96,88.14 50.02,88.08 | 50.02,98.25 DD2.15 | 50.02,108.4 49.96,108.34 49.96,98.31 50.02,98.25 | 50.02,108.4 DD3.15 | DD4.15 50.98,119.51 49.96,118.49 49.96,108.46 50.02,108.4 | DD8.15 49.96,69.76 49.96,74.96 50.16,75.16 50.16,75.74 49.96,75.94 49.96,79.81 50.02,79.88
50HZ  (via drill 0.2)
  Top 0.203: v177.53,73.89 164.01,73.89 IC2.2 | v181.28,74.69 187.96,74.69 189.23,73.41 193.28,73.41 195.41,71.29 196.71,71.29 S1.7
  Bottom 0.203: v177.53,73.89 180.61,76.96 181.48,76.96 181.48,74.89 v181.28,74.69
4608M  (via drill 0.2)
  Top 0.203: v166.31,77.39 155.88,77.39 152.58,80.69 v152.58,82.91 | v152.58,98.99 152.38,98.79 113.73,98.79 113.63,98.69 v65.53,98.69 | v70.61,59.11 v63.18,59.11
  Bottom 0.203: R57.2 72.35,60.7 IC4.10 | v166.31,77.39 166.31,74.94 IC2.1 | v152.58,98.99 v152.58,82.91 | v65.53,98.69 65.46,98.61 65.46,77.01 63.58,75.14 63.58,72.14 63.18,71.74 v63.18,59.11 | v70.61,59.11 70.75,59.11
  Bottom 0.61: 70.75,50.43 70.75,59.11 70.75,60.4 IC4.10
  Bottom 0.813: Q2.2 70.75,50.43
+5V  (via drill 0.2, 0.4 pad 0.41, 0.6)  (5 unrouted)
  Top 0.202: 77.86,68.94 76.16,70.64 72.97,70.64
  Top 0.203: v22.41,56.67 v22.41,56.66 22.23,56.69 | 53.51,58.59 DD6.16 53.41,58.59 50.98,58.59 DD6.15 | RN6.1 | R58.1 194.16,63.79 192.61,62.24 189.18,62.24 IC2.32 189.08,62.24 180.28,62.24 179.21,62.24 | IC2.7 166.33,67.31 178.13,67.31 179.22,67.31 | IC17.14 204.96,98.56 203.46,97.06 195.06,97.06 193.48,95.49 D10.K | R11.2 191.93,110.64 189.58,110.64 D4.K 189.56,110.74 189.03,111.26 IC3.21 | R2.2 187.61,107.96 189.56,107.96 D6.K 189.66,107.96 191.78,107.96 D7.K | v176.13,127.16 R65.2 | 179.25,80.64 C28.1 | C6.+ 176.32,43.65 | 77.86,68.94 81.86,68.94 IC19.5 | v95.04,64.45 v95.03,64.44 v95.04,64.45 | v93.05,64.45 v93.06,64.44 v93.05,64.45 | v100.43,51.11 | v94.56,51.11 | v87.73,50.95 87.59,50.96 87.49,50.93 | 86.86,50.93 86.86,50.94 v86.86,50.95 | v91.23,51.11 | DD5.15 53.51,28.09 DD5.16 | DD7.16 DD7.15 | 103.63,51.09 | 103.63,51.09 v103.61,51.11
  Top 0.254: 92.93,64.57 v93.05,64.45 | 105.93,70.18 v105.83,70.08 | 107.44,64.43 v107.42,64.45 | 103.64,55.43 103.61,55.4 | IC19.85 | 94.93,47.94 94.96,47.94 | 87.49,50.93 86.88,51.11 | 91.22,59.93 arc-90 91.22,59.92
  Top 0.305: IC19.191 92.93,64.57 | IC19.186 95.43,67.22 94.88,66.67 94.88,64.61 v95.04,64.45 | IC19.179 98.93,67.78 v99.64,67.07 | IC19.165 105.93,70.18 | IC19.143 107.44,64.43 | IC19.125 103.64,55.43 | v103.61,51.11 103.63,51.09 104.56,50.16 105.59,50.16 109.33,46.43 IC19.107 | IC19.85 100.43,45.87 | 100.43,45.87 v100.43,51.11 | IC19.83 99.43,45.87 100.43,45.87 | IC19.74 94.93,47.94 94.93,47.96 94.56,48.33 v94.56,51.11 | IC19.63 89.43,45.19 91.23,46.98 v91.23,51.11 | IC19.41 86.86,50.93 87.49,50.93 | IC19.23 91.22,59.93
  Top 0.406: RN1.1 64.63,9.6 v57.33,9.6 | C26.1 arc-90 182.55,25.75 IC16.30 175.2,25.75 175.2,25.71 | C6.+ 175.83,43.05 IC16.42 175.83,33.25 171.95,33.25 | IC16.63 164.17,29.75 164.17,29.84
  Top 0.813: IC4.14 72.97,70.56 72.97,70.64 72.97,78.97 | 189.17,3.25 189.17,24.28 | 189.17,24.28 R6.2 | C26.1 189.17,25.95 189.17,24.28 | C29.1 189.17,3.25 | 189.17,3.25 187.03,3.25 187.03,3.33 | 175.2,25.71 171.95,25.71 171.95,29.84 | 171.95,29.84 171.95,33.25 | 164.17,29.84 171.95,29.84
  Top 1.422: C1.+ 23.37,75.69 21.77,75.69 | C27.+ v21.77,65.88 | C3.+ 77.97,78.5 77.97,78.97 | C4.+ 154.25,85.68 C24.1
  Top 1.778: XP1.BA18 22.41,126.69 v22.41,126.83 | XP1.AA18 22.23,56.69 22.23,56.67
  Top 2.184: 179.25,80.64 179.22,67.31 179.21,62.24 179.21,47.26 179.17,47.22 | 179.41,46.98 179.41,46.75 176.32,43.65
  Top 2.54: 77.97,78.97 72.97,78.97 v57.49,78.97 | 86.88,51.11 v91.23,51.11
  Bottom 0.202: R7.1 105.83,68.73
  Bottom 0.203: v91.23,51.12 v91.23,51.11 | v103.61,51.11 103.63,51.12 v103.61,51.11 | v22.41,56.67 v22.41,56.66 22.31,56.66 | v21.77,65.88 21.78,65.89 22.29,65.89 | RN15.1 53.53,8.16 DD16.16 | RN14.1 53.53,20.14 53.53,18.34 DD15.16 | RN11.1 53.56,30.21 53.56,28.59 DD5.16 53.53,28.49 | RN13.1 53.53,38.64 DD14.16 | 53.53,50.94 RN12.1 53.56,50.84 53.56,48.81 DD7.16 53.53,48.01 53.53,45.89 DD14.1 | RN16.1 53.53,61.01 53.53,59.06 DD6.16 53.53,58.96 | RN9.1 53.53,69.14 DD8.16 | 119.96,22.14 119.96,22.77 | RN8.1 53.53,81.41 53.53,79.29 DD1.16 | RN10.1 53.53,89.44 DD9.16 | RN4.1 53.53,109.76 DD3.16 | RN7.1 53.53,119.94 DD4.16 | IC2.30 IC2.32 | 165.28,67.66 166.31,67.66 IC2.7 | 165.28,67.66 164.68,67.66 IC2.6 | 165.28,67.66 165.28,71.34 166.31,72.36 IC2.3 | D4.K 189.58,110.64 189.58,107.96 D6.K | IC3.21 182.43,111.29 IC3.22 182.33,113.86 181.41,114.79 181.41,118.74 | v176.13,127.16 174.89,127.16 | 186.36,80.64 186.36,94.31 187.51,95.46 D10.K | v94.56,51.11 | 57.33,57.09 57.33,58.97 | v100.43,51.11 | v93.05,64.45 v93.06,64.44 v93.06,64.45 | v95.04,64.45 v95.03,64.44 v95.03,64.45 | R8.1 57.33,82.31 | 58.93,87.86 57.33,88.74 | 20.91,75.29 22.27,75.28 | 138.46,19.28 138.46,31.96 RN19.1 | RN5.1 53.53,101.74 53.53,99.61 DD2.16 | v57.49,78.97 57.51,78.96 57.33,78.96 | C5.+ 97.28,126.44 97.28,129.37 | 146.69,19.98 146.31,20.36 146.07,19.28 | 154.98,40.79 155.6,40.79 | 72.26,126.16 72.26,129.37 | 156.73,105.96 158.61,106.28 | 57.01,95.14 57.02,95.14 57.33,95.14 | 130.83,126.56 130.83,129.37 | 174.89,127.59 174.88,127.59 174.88,128.66
  Bottom 0.254: 57.33,126.52 58.6,127.79 58.92,128.11 58.92,129.37 | 99.64,64.92 99.16,64.45 | 105.83,64.45
  Bottom 0.305: v99.64,67.07 99.64,64.92 | v105.83,70.08 105.83,68.73 105.83,64.45
  Bottom 0.406: RN3.1 arc-90 119.8,16.66 119.8,22.77 | 89.8,22.77 89.8,29.05 RN18.1 RN17.1 | C15.1 74,22.14 74,22.77
  Bottom 0.61: 92.73,17.69 92.42,18.01 92.42,20.87
  Bottom 0.813: DD16.16 57.02,7.77 57.33,8.41 | DD15.16 57.33,17.93 | DD5.16 57.33,28.09 57.33,28.41 | DD14.16 57.33,38.25 | DD7.16 57.33,48.41 | DD6.16 57.33,58.57 | DD8.16 57.33,68.73 57.33,58.97 | DD1.16 57.02,78.89 57.33,78.58 | DD9.16 57.02,89.05 57.33,88.74 | DD2.16 57.02,99.21 57.33,98.89 | DD3.16 57.33,109.37 | DD4.16 57.33,119.53 | v107.42,64.45 105.83,64.45 99.16,64.45 C21.1 | 57.02,131.28 57.33,130.96 | JP3.4 76.46,91.04 72.26,91.04 CON1.30A | 155.68,49.68 155.68,40.79 154.98,40.79 RN20.1 | IC3.24 182.27,118.74 181.41,118.74 174.89,118.74 | IC6.28 155.68,49.68 | IC5.28 155.68,65.95 C23.1 155.68,49.68
  Bottom 1.016: C21.1 v95.03,64.45 v93.06,64.45 91.22,64.45 C13.1 v91.22,51.11 v91.23,51.11 v94.56,51.11 C12.1 v100.43,51.11 v103.61,51.11 C20.1
  Bottom 1.27: RN2.1 146.07,19.28 | IC14.20 101.31,22.77 | IC1.43 92.73,17.69 | 92.42,20.87 92.5,22.77 | IC2.42 189.17,80.64 186.36,80.64 179.25,80.64 | 145.84,19.12 146.69,19.98 155.6,28.89 155.6,40.79 155.6,40.87
  Bottom 1.422: 57.02,131.28 58.29,131.28 58.29,128.42 58.6,128.42 58.6,127.79 | C30.1 IC1.64
  Bottom 1.778: XP1.BB1 22.27,75.69 22.27,74.76 | XP1.AB1 22.09,5.69 22.41,5.23
  Bottom 1.93: 97.26,128.9 90.04,128.9
  Bottom 2.184: 57.33,8.41 57.33,9.36 | CON1.30A CON1.30 72.26,105.96 | C7.1 72.26,105.96 | 72.26,105.96 57.02,105.96 57.02,95.14 57.02,84.29 | 57.33,23.65 57.33,23.41 | C8.1 145.91,105.96 | 145.91,105.96 CON1.1 CON1.1A | 158.69,105.48 158.69,105.96 156.73,105.96 145.91,105.96 | C17.1 87.42,124.14 87.42,129.06 72.26,129.06 72.26,126.16 CON2.30 CON2.30A | 57.32,43.33 57.33,41.75 | C16.1 130.83,124.37 130.83,126.56 130.83,128.74 145.91,128.82 | 145.91,128.82 CON2.1 CON2.1A | 145.91,128.82 158.14,128.82 158.14,125.17 | 158.14,125.09 158.14,125.17 | 158.14,125.17 158,105.09 157.98,102.39 157.96,89.06 | RN6.1 IC1.64 RN2.1 | 146.07,19.28 138.46,19.28 IC15.20 128.61,22.77 119.96,22.77 119.8,22.77 101.31,22.77 92.5,22.77 89.8,22.77 74,22.77 57.33,22.77 | C5.+ 97.26,128.9 | 179.25,80.64 C28.1 | 175.05,128.66 174.88,128.66 158.61,128.66
  Bottom 2.54: C24.1 158,85.48 158,105.09 | 57.33,47.7 C25.1 86.86,47.7 v86.86,50.95 | C28.1 179.25,86.35 174.89,90.72 174.89,118.74 174.89,127.16 174.89,127.59 174.89,128.5
  Bottom 3.81: 57.33,126.52 57.33,119.53 57.33,109.37 57.33,98.89 57.33,95.14 57.33,88.74 57.33,82.31 57.33,78.96 57.33,78.58 57.33,58.97 | 57.33,58.57 57.33,57.09 57.33,48.41 57.33,47.7 57.33,41.75 57.33,38.25 57.33,28.41 57.33,23.41 57.33,22.77 57.33,17.93 C14.1 v57.33,9.6 57.33,9.36 | 158.61,106.28 158.61,128.66 158.61,129.37
  Bottom 5: 57.33,130.96 22.41,130.96 v22.41,126.83
  Bottom 6.452: v22.41,126.83 22.27,75.28 22.27,74.76 22.29,65.89 22.31,56.66 22.41,5.23 | 58.92,129.37 72.26,129.37 97.28,129.37 130.83,129.37 158.61,129.37
  other vias: 92.18,51.11
/DREADY
  Top 0.203: IC16.17 169.81,18.25 169.81,19.45 169.46,19.8 169.46,19.99 131.91,19.99 128.36,16.44 128.31,16.44 RN2.8
  Bottom 0.203: IC1.56 125.76,12.64 126.36,13.24 127.46,13.24 127.46,13.34 128.28,14.16 128.28,16.41 RN2.8
/FD  (via drill 0.2)
  Top 0.203: v134.46,17.66 136.36,19.56 162.46,19.56 162.46,19.57 162.81,19.21 IC16.10
  Bottom 0.203: v134.46,17.66 133.38,16.59 133.38,16.44 RN2.6 133.28,16.39 133.28,15.06 130.86,12.64 IC1.58
/FL
  Top 0.202: 163.46,16.94 163.83,17.31 IC16.11
  Top 0.203: 163.46,16.94 153.33,16.94 152.38,17.89 138.11,17.89 137.26,17.04 136.76,17.04 136.33,17.46 135.13,17.46 134.71,17.04 134.21,17.04 133.78,17.46 131.88,17.46 130.86,16.44 RN2.7
  Bottom 0.203: IC1.57 128.31,12.64 130.83,15.16 RN2.7
/FPPRD  (via drill 0.2)
  Top 0.202: 167.13,16.16 167.83,16.86 IC16.15
  Top 0.203: v167.13,15.94 167.13,16.16 | v167.13,10.74 156.01,10.74 154.71,9.44 152.06,9.44 150.88,8.26 v120.68,8.26
  Bottom 0.203: v167.13,10.74 v167.13,15.94 | v120.68,8.26 IC1.54 120.78,12.64 120.78,13.99 RN2.10
/FPPTR
  Top 0.203: IC16.14 166.81,18.24 166.81,16.49 165.23,14.91 134.16,14.91 133.68,15.39 118.53,15.39 RN3.2
  Bottom 0.203: IC1.53 118.13,12.64 117.51,13.26 RN3.2
/LIN
  Top 0.202: 163.85,16.51 164,16.66 164.81,16.66 164.83,16.69 IC16.12
  Top 0.203: 163.85,16.51 153.18,16.51 152.23,17.46 139.48,17.46 138.46,16.44 RN2.4
  Bottom 0.203: IC1.61 138.46,12.64 RN2.4
/RX  (via drill 0.2)
  Top 0.203: v176.78,46.39 161.43,46.39 159.63,48.19 124.08,48.19 123.33,47.44 112.48,47.44 IC19.109 | v181.43,57.14 189.16,57.14 IC2.28
  Bottom 0.203: v176.78,46.39 181.21,50.81 181.21,54.14 181.43,54.36 v181.43,57.14
/TX  (via drill 0.2)
  Top 0.203: v111.36,48.66 111.58,48.44 112.46,48.44 IC19.111 | v123.21,58.89 v114.23,58.89 | v124.93,75.91 125.51,75.34 v165.08,75.34 | v168.18,62.69 177.33,62.69 v177.61,62.41 | v180.81,55.89 186.63,55.89 IC2.27
  Bottom 0.203: v111.36,48.66 114.23,51.54 v114.23,58.89 | v123.21,58.89 123.21,74.19 v124.93,75.91 | v165.08,75.34 165.28,75.14 165.28,74.09 165.96,73.41 168.18,73.41 v168.18,62.69 | v177.61,62.41 180.81,59.21 v180.81,55.89
ACLO  (via drill 0.2)
  Top 0.203: v116.81,49.41 IC19.113 | v116.81,43.84 117.01,44.04 132.53,44.04 132.73,43.84 v142.18,43.84 | v142.23,21.51 132.28,21.51 129.03,18.26 v125.18,18.26 | v26.28,59.66 37.21,59.66 38.28,58.59 DD6.10 | v26.28,10.16 26.08,9.96 26.03,9.96 25.66,9.59 25.66,6.31 56.33,6.31 57.71,7.69 71.11,7.69 71.78,7.01 100.28,7.01 v100.33,7.06 | v104.98,9.96 123.01,9.96 RN6.10
  Bottom 0.203: v116.81,43.84 v116.81,49.41 | v142.18,43.84 142.18,41.36 142.03,41.21 142.03,36.06 142.23,35.86 v142.23,21.51 | v125.18,18.26 124.66,17.74 124.66,14.71 123.58,13.64 122.18,13.64 122.18,10.79 RN6.10 | v26.28,10.16 v26.28,59.66 | 100.33,9.96 100.33,12.61 IC1.46 | 100.33,9.96 v100.33,7.06 | 100.33,9.96 v104.98,9.96
ACLO_P  (via drill 0.2)
  Top 0.203: v110.06,54.04 110.16,53.94 112.46,53.94 IC19.122 | v108.76,77.11 108.68,77.19 101.78,77.19 101.41,77.56 101.41,82.84 v101.48,82.84 | 190.93,123.01 R5.1 | 190.93,123.01 v101.48,123.01 | v193.13,94.86 196.16,94.86 197.33,96.04 IC17.2 | v190.93,122.91 190.93,123.01
  Bottom 0.203: v110.06,54.04 109.38,54.71 109.38,76.49 v108.76,77.11 | v101.48,123.01 v101.48,82.84 | v193.13,94.86 192.98,95.01 192.98,118.31 190.93,120.36 v190.93,122.91
AD0  (via drill 0.2)
  Top 0.203: 161.26,99.61 156.91,99.61 156.23,98.94 153.51,98.94 150.43,102.01 141.98,102.01 140.86,100.89 CON1.3 | 161.26,99.61 181.38,99.61 182.41,98.59 IC3.16 | v161.66,117.04 154.96,117.04 154.86,117.14 142.68,117.14 140.86,118.96 CON2.3 | v161.26,99.71 161.26,99.61 | 127.13,24.34 127.13,24.39 v126.08,24.39 | 127.13,24.34 127.13,20.34 126.08,19.29 IC15.19 | v121.31,34.36 117.81,34.36 117.48,34.69 117.11,34.69 117.11,35.41 116.01,36.51 103.23,36.51 102.81,36.94 97.88,36.94 97.88,38.14 96.11,39.91 94.43,39.91 IC19.73 | v123.33,30.34 v125.98,30.34 | v170.06,39.29 170.03,39.26 162.21,39.26 162.21,39.25 161.83,38.87 IC16.56 161.78,37.66 161.21,37.09 148.73,37.09 v148.53,36.89 | v127.41,67.06 165.06,67.06 v165.08,67.04 | 123.48,76.49 97.11,76.49 96.73,76.86 81.56,76.86 81.56,77.96 78.96,80.56 56.98,80.56 56.83,80.41 39.78,80.41 38.28,78.91 DD1.10 | 123.48,76.49 126.38,73.59 126.78,73.59 IC5.11 | v148.53,24.34 127.13,24.34 | v138.93,82.86 132.66,76.59 123.51,76.59 123.48,76.49
  Bottom 0.203: 123.23,31.97 RN19.7 | v161.66,117.04 161.66,107.91 161.26,107.51 v161.26,99.71 | v126.08,24.39 126.08,26.89 IC15.2 125.98,26.94 v125.98,30.34 | v121.31,34.36 121.83,34.89 123.21,34.89 IC1.10 123.23,34.79 123.23,32.09 RN19.7 | v123.33,30.34 123.33,31.94 RN19.7 | v170.06,39.29 169.86,39.49 169.86,44.41 169.23,45.04 169.23,51.61 169.43,51.81 169.43,60.56 166.33,63.66 166.33,64.76 IC2.9 166.23,64.81 166.23,65.89 v165.08,67.04 | v127.41,67.06 127.41,72.96 126.81,73.56 IC5.11 | v148.53,36.89 v148.53,24.34 | v138.93,82.86 139.43,83.36 139.43,99.46 140.83,100.86 CON1.3
AD1  (via drill 0.2)
  Top 0.203: IC1.11 121.08,35.46 122.63,33.91 134.43,33.91 134.63,34.11 146.58,34.11 147.83,35.36 157.61,35.36 157.98,35.74 IC16.57 159.88,35.84 v171.73,35.84 | IC15.18 123.51,19.29 122.96,19.84 122.96,26.89 123.51,26.89 IC15.3 | v108.83,34.44 101.86,34.44 101.86,35.41 100.76,36.51 97.46,36.51 97.46,37.99 95.96,39.49 93.43,39.49 IC19.71 | v108.83,32.09 108.93,32.19 113.93,32.19 115.16,30.96 119.66,30.96 120.66,31.96 RN19.8 | v125.28,61.39 127.76,61.39 128.16,60.99 160.16,60.99 161.91,62.74 162.78,62.74 162.93,62.89 163.16,62.89 163.76,63.49 IC2.10 163.81,63.59 163.96,63.74 170.93,63.74 v171.13,63.94 | v46.78,88.09 46.86,88.01 54.46,88.01 54.93,88.49 89.38,88.49 89.86,88.01 109.66,88.01 109.71,88.06 140.63,88.06 v140.81,88.24 | v140.88,97.06 160.63,97.06 | 160.63,97.06 181.38,97.06 182.41,96.04 IC3.15 | v161.03,109.44 154.63,109.44 154.08,109.99 142.21,109.99 140.86,111.34 CON2.3A | v160.63,97.11 160.63,97.06 | v162.13,78.24 162.06,78.31 161.43,78.31 160.66,79.09 v160.66,82.51
  Bottom 0.203: v108.83,32.09 v108.83,34.44 | IC15.3 123.51,26.91 120.68,29.74 120.68,31.96 RN19.8 120.68,32.06 IC1.11 | v125.28,61.39 125.28,72.54 IC5.12 | v46.78,88.09 46.93,87.94 46.93,79.94 45.91,78.91 DD1.13 | v140.81,88.24 140.83,88.26 140.83,93.24 CON1.3A 140.88,93.34 v140.88,97.06 | v161.03,109.44 160.83,109.24 160.83,100.16 160.63,99.96 v160.63,97.11 160.66,97.01 v160.66,82.51 | v162.13,78.24 162.13,71.79 162.21,71.71 162.21,65.06 163.76,63.51 IC2.10 | v171.73,35.84 171.53,36.04 171.53,44.49 170.51,45.51 170.51,51.16 170.71,51.36 170.71,60.41 171.13,60.84 v171.13,63.94
AD2  (via drill 0.2)
  Top 0.203: v68.26,85.56 68.18,85.49 49.48,85.49 DD1.3 | v68.26,103.09 68.46,103.29 102.41,103.29 103.68,102.01 129.46,102.01 | 129.46,102.01 132.08,102.01 CON1.6 | 129.46,102.01 v129.46,102.49 | v171.31,35.01 161.83,35.01 161.58,34.76 IC16.58 159.49,34.76 158.53,34.76 158.13,34.36 147.41,34.36 146.53,33.49 v144.56,33.49 | v170.48,62.06 166.48,62.06 166.33,62.21 IC2.11 | v181.03,82.04 173.61,82.04 v170.51,78.94 | IC15.17 120.43,19.84 120.43,26.89 120.98,26.89 IC15.4 | v93.26,43.99 92.93,43.99 92.93,42.89 IC19.70 | v106.21,41.19 106.53,41.51 v122.81,41.51 122.83,41.61 123.56,42.34 130.98,42.34 v131.58,41.74 131.63,41.81 v144.56,41.81 | v131.58,36.46 131.53,36.51 119.18,36.51 118.16,35.49 IC1.12 | v134.41,90.64 155.93,90.64 157.11,89.46 168.38,89.46 168.78,89.86 v181.26,89.86
  Bottom 0.203: v68.26,103.09 v68.26,85.56 | v129.46,102.49 129.26,102.69 129.26,106.54 131.81,109.09 131.81,117.56 CON2.6 | v171.31,35.01 171.11,35.21 171.11,44.31 170.08,45.34 170.08,51.31 170.28,51.51 170.28,60.56 170.48,60.76 v170.48,62.06 170.51,62.16 v170.51,78.94 | v181.03,82.04 181.26,82.26 v181.26,89.86 181.26,92.34 182.41,93.49 IC3.14 | IC1.12 RN19.9 118.23,31.96 118.93,31.26 118.93,29.61 120.98,27.56 IC15.4 | v93.26,43.99 94.31,45.04 104.08,45.04 104.08,45.06 105.36,46.34 106.26,46.34 106.26,41.24 v106.21,41.19 | v122.81,41.51 122.81,50.19 122.66,50.34 122.66,56.74 122.81,56.89 122.81,58.41 122.58,58.64 122.58,65.39 122.73,65.54 122.73,72.54 IC5.13 | v131.58,41.74 v131.58,36.46 | v144.56,41.81 v144.56,33.49 | v134.41,90.64 134.41,99.69 133.23,100.86 CON1.6
AD3  (via drill 0.2)
  Top 0.203: IC15.16 118.46,23.06 119.01,23.61 119.01,26.89 118.46,26.89 IC15.5 | v86.21,40.04 92.41,40.04 92.41,42.86 IC19.69 | v86.21,28.14 86.36,27.99 104.81,27.99 105.23,28.41 111.26,28.41 v111.41,28.56 | v170.68,33.76 166.71,33.76 | 166.71,33.76 IC16.59 | v169.86,61.01 169.81,60.96 IC2.12 | v119.18,62.01 129.98,62.01 130.58,61.41 160.01,61.41 161.96,63.36 v162.53,63.36 | v119.21,7.64 153.38,7.64 154.76,9.01 156.71,9.01 157.81,10.11 v166.51,10.11 | v166.71,33.56 166.71,33.76 | v39.78,94.56 39.98,94.76 60.31,94.76 61.78,96.24 96.88,96.24 97.51,95.61 106.41,95.61 106.43,95.64 127.21,95.64 | 127.21,95.64 130.83,95.64 CON1.6A 133.23,93.16 135.06,91.34 155.81,91.34 157.21,89.94 166.03,89.94 | IC3.13 181.96,90.49 168.16,90.49 167.61,89.94 166.03,89.94 | v127.21,110.24 132.11,110.24 133.21,111.34 CON2.6A | v127.21,95.56 127.21,95.64 | v169.26,78.94 166.03,82.16 v166.03,82.51 | v166.03,90.09 166.03,89.94
  Bottom 0.203: v86.21,28.14 v86.21,40.04 | v111.41,28.56 111.61,28.76 111.61,30.86 112.43,31.69 112.43,31.81 112.81,32.19 115.58,32.19 115.58,31.99 RN19.10 | IC1.13 115.61,32.29 RN19.10 | IC15.5 118.43,26.91 117.41,27.94 117.41,29.56 115.68,31.29 115.68,31.94 RN19.10 | v170.68,33.76 170.68,44.16 169.66,45.19 169.66,51.46 169.86,51.66 v169.86,61.01 169.86,64.09 170.08,64.31 170.08,78.11 v169.26,78.94 | v119.18,62.01 119.18,65.94 IC5.15 | v162.53,63.36 162.76,63.14 162.76,62.39 163.76,61.39 163.76,60.96 IC2.12 | v119.21,7.64 119.21,12.99 119.01,13.19 119.01,18.71 118.46,19.26 IC15.16 | v166.51,10.11 166.51,28.31 166.71,28.51 v166.71,33.56 | v39.78,94.56 39.78,87.54 DD1.6 | v127.21,110.24 127.01,110.04 127.01,95.76 v127.21,95.56 | v166.03,90.09 v166.03,82.51
AD4  (via drill 0.2)
  Top 0.203: v37.26,123.59 37.31,123.54 86.63,123.54 90.06,120.11 121.91,120.11 123.03,118.99 CON2.10 | v123.06,113.91 164.56,113.91 167.18,111.29 IC3.4 | IC15.15 115.36,19.84 115.36,26.89 115.91,26.89 IC15.6 | v91.71,43.99 91.91,43.99 91.91,42.89 IC19.68 | v91.51,32.61 91.91,33.01 95.33,33.01 96.98,31.36 111.43,31.36 | 111.43,31.36 112.86,31.36 v113.06,31.56 | v111.43,31.56 111.43,31.36 | v164.83,32.76 IC16.60 | v171.13,45.76 v164.83,45.76 164.76,45.71 131.46,45.71 131.32,45.57 | v171.96,59.66 166.33,59.66 IC2.13 | v121.08,77.99 123.98,80.89 v123.98,82.84 | 131.32,45.57 131.06,45.31 116.38,45.31 v116.18,45.51 | v116.18,66.81 116.36,66.99 120.66,66.99 121.68,65.96 IC5.16 | v121.91,35.51 121.91,35.21 122.68,34.44 129.08,34.44 v129.18,34.54 | v131.53,45.51 131.38,45.51 131.32,45.57
  Bottom 0.203: DD2.10 37.26,100.24 v37.26,123.59 | CON2.10 v123.06,113.91 123.16,113.89 124.18,112.86 124.18,99.86 124.12,99.8 | v91.71,43.99 91.71,32.81 v91.51,32.61 | v113.06,31.56 113.06,29.46 RN18.10 113.16,29.44 113.38,29.44 IC15.6 | v111.43,31.56 111.43,33.86 113.03,35.46 IC1.14 113.16,35.49 114.61,36.94 121.91,36.94 v121.91,35.51 | v164.83,45.76 v164.83,32.76 | v171.13,45.76 171.13,57.36 171.96,58.19 v171.96,59.66 | v121.08,77.99 121.08,77.94 120.68,77.54 120.68,73.14 120.81,73.01 120.81,66.84 121.68,65.96 IC5.16 | v123.98,82.84 124.18,83.04 124.18,99.74 124.12,99.8 | 124.12,99.8 123.06,100.86 CON1.10 | v116.18,66.81 v116.18,45.51 | v129.18,34.54 129.33,34.69 129.33,38.26 128.91,38.69 128.91,42.89 v131.53,45.51
AD5  (via drill 0.2)  (1 unrouted)
  Top 0.203: v86.83,40.66 91.58,40.66 91.58,42.01 91.43,42.16 IC19.67 | v87.08,24.39 87.58,23.89 v87.58,21.16 | v105.58,14.76 v87.58,14.76 | v106.06,16.04 106.71,15.39 113.41,15.39 v113.46,15.44 | v144.18,31.74 159.81,31.74 IC16.61 159.88,31.84 v165.46,31.84 | v144.18,24.96 144.13,25.01 124.48,25.01 124.11,24.64 124.11,20.16 124.56,19.71 124.56,18.26 114.38,18.26 113.38,19.26 IC15.14 113.36,19.39 113.36,26.89 IC15.7 | v116.78,29.31 115.66,29.31 114.51,30.46 111.53,30.46 110.53,29.46 RN18.9 | IC3.5 125.66,108.74 123.06,111.34 CON2.10A | v123.03,98.06 65.28,98.06 65.21,98.14 46.98,98.14 DD2.13 | v172.61,47.01 v165.46,47.01 | v172.83,77.16 172.73,77.06 169.68,77.06 164.78,81.96 v164.78,82.51 | v124.28,68.89 124.48,69.09 162.83,69.09 163.36,69.61 165.11,69.61 165.91,68.81 171.73,68.81 v171.76,68.84 | v171.33,58.44 163.78,58.44 IC2.14
  Bottom 0.203: RN18.9 110.51,29.46 IC1.15 | v86.83,40.66 86.83,38.56 86.63,38.36 86.63,28.59 87.08,28.14 v87.08,24.39 | v87.58,14.76 v87.58,21.16 | v105.58,14.76 106.06,15.24 v106.06,16.04 | v113.46,15.44 113.46,19.19 113.38,19.26 IC15.14 | v144.18,24.96 v144.18,31.74 | v116.78,29.31 116.93,29.16 116.93,26.46 116.33,25.86 113.38,25.86 113.38,26.89 IC15.7 | CON1.10A 123.03,93.26 v123.03,98.06 122.93,98.09 121.93,99.09 121.93,110.24 123.03,111.34 CON2.10A | v165.46,47.01 v165.46,31.84 | v172.61,47.01 172.61,54.79 173.21,55.39 173.21,70.74 172.83,71.11 v172.83,77.16 | v164.78,82.51 164.78,95.29 165.33,95.84 165.33,106.89 IC3.5 | v124.28,68.89 124.28,65.99 IC5.17 | v171.76,68.84 171.76,60.34 171.33,59.91 v171.33,58.44
AD6  (via drill 0.2)
  Top 0.203: IC15.13 110.83,26.89 IC15.8 | v93.21,44.81 90.93,44.81 90.93,42.89 IC19.66 | v96.11,44.41 v96.11,45.66 | v107.96,31.99 v98.83,31.99 | v167.33,30.76 IC16.62 159.81,30.86 144.18,30.86 141.61,33.44 115.03,33.44 114.98,33.39 108.13,33.39 v108.08,33.34 | v126.81,60.31 126.98,60.14 162.51,60.14 v162.68,60.31 | v162.68,57.16 166.31,57.16 IC2.15 | DD2.3 48.46,106.81 49.46,105.81 62.06,105.81 68.76,99.11 113.48,99.11 115.23,100.86 115.43,100.86 CON1.13 | v115.46,103.71 141.96,103.71 | 141.96,103.71 v165.96,103.71 | v125.76,75.96 125.96,76.16 137.11,76.16 141.23,80.29 v141.23,82.89 | v141.96,103.61 141.96,103.71
  Bottom 0.203: v93.21,44.81 93.51,44.81 94.36,45.66 v96.11,45.66 | v96.11,44.41 95.68,43.99 95.68,39.71 95.08,39.11 95.08,38.61 95.46,38.24 97.78,38.24 97.78,36.96 98.83,35.91 v98.83,31.99 | 107.98,33.34 107.98,32.09 v107.96,31.99 107.96,29.46 RN18.8 108.06,29.39 108.33,29.39 110.81,26.91 IC15.8 | 107.98,33.34 IC1.16 | v167.33,30.76 167.33,53.06 167.31,53.09 167.31,54.14 167.33,54.16 167.33,56.14 166.33,57.14 IC2.15 | v126.81,60.31 126.81,65.94 IC5.18 126.68,65.96 125.76,66.89 v125.76,75.96 | v162.68,57.16 v162.68,60.31 | v108.08,33.34 107.98,33.34 | v165.96,103.71 165.96,104.96 IC3.6 | CON1.13 115.46,100.89 v115.46,103.71 115.36,103.74 114.88,104.21 114.88,109.86 114.31,110.44 114.31,117.84 CON2.13 | v141.23,82.89 141.43,83.09 141.43,92.26 141.96,92.79 v141.96,103.61
AD7  (via drill 0.2)
  Top 0.203: v54.91,105.19 42.46,105.19 40.83,106.81 DD2.6 | v54.91,108.44 55.08,108.61 v115.51,108.61 115.53,108.51 116.36,107.69 117.43,107.69 117.63,107.89 162.96,107.89 IC3.7 | IC15.12 108.28,26.89 IC15.9 | v90.96,41.76 90.43,41.76 IC19.65 | v91.08,33.34 91.28,33.54 105.23,33.54 v105.43,33.34 | v166.08,28.76 IC16.64 | v171.76,45.14 v166.08,45.14 | v171.76,56.26 171.56,56.06 163.96,56.06 163.78,55.89 IC2.16 | v128.31,77.36 120.01,77.36 118.76,78.61 118.76,83.46 v115.46,83.46 | v146.81,53.04 v162.53,53.04 | v128.38,54.91 v146.81,54.91 | v106.96,8.29 107.16,8.09 116.73,8.09 118.66,6.16 155.01,6.16 157.71,8.86 165.26,8.86 v165.88,9.49
  Bottom 0.203: v54.91,108.44 v54.91,105.19 | CON2.13A 115.46,111.34 115.46,108.66 v115.51,108.61 115.61,108.59 116.56,107.64 116.56,99.64 115.56,98.64 115.56,93.26 CON1.13A 115.46,93.24 v115.46,83.46 | v90.96,41.76 91.23,41.49 91.23,33.49 v91.08,33.34 | IC1.17 v105.43,33.34 105.43,29.46 RN18.7 105.53,29.41 105.78,29.41 IC15.9 | v166.08,45.14 v166.08,28.76 165.98,28.74 165.88,28.64 v165.88,9.49 | v171.76,56.26 v171.76,45.14 | 128.45,66.83 128.31,66.96 v128.31,77.36 | 128.45,66.83 129.31,65.96 IC5.19 | v162.53,53.04 162.73,53.24 162.73,54.84 163.76,55.86 IC2.16 | v146.81,54.91 v146.81,53.04 | v128.38,54.91 128.38,66.76 128.45,66.83 | v106.96,8.29 106.96,14.09 108.36,15.49 108.36,19.21 108.31,19.26 IC15.12
AD8  (via drill 0.2)